# EAGLE design LPT3,5 (EAGLE 6.3)
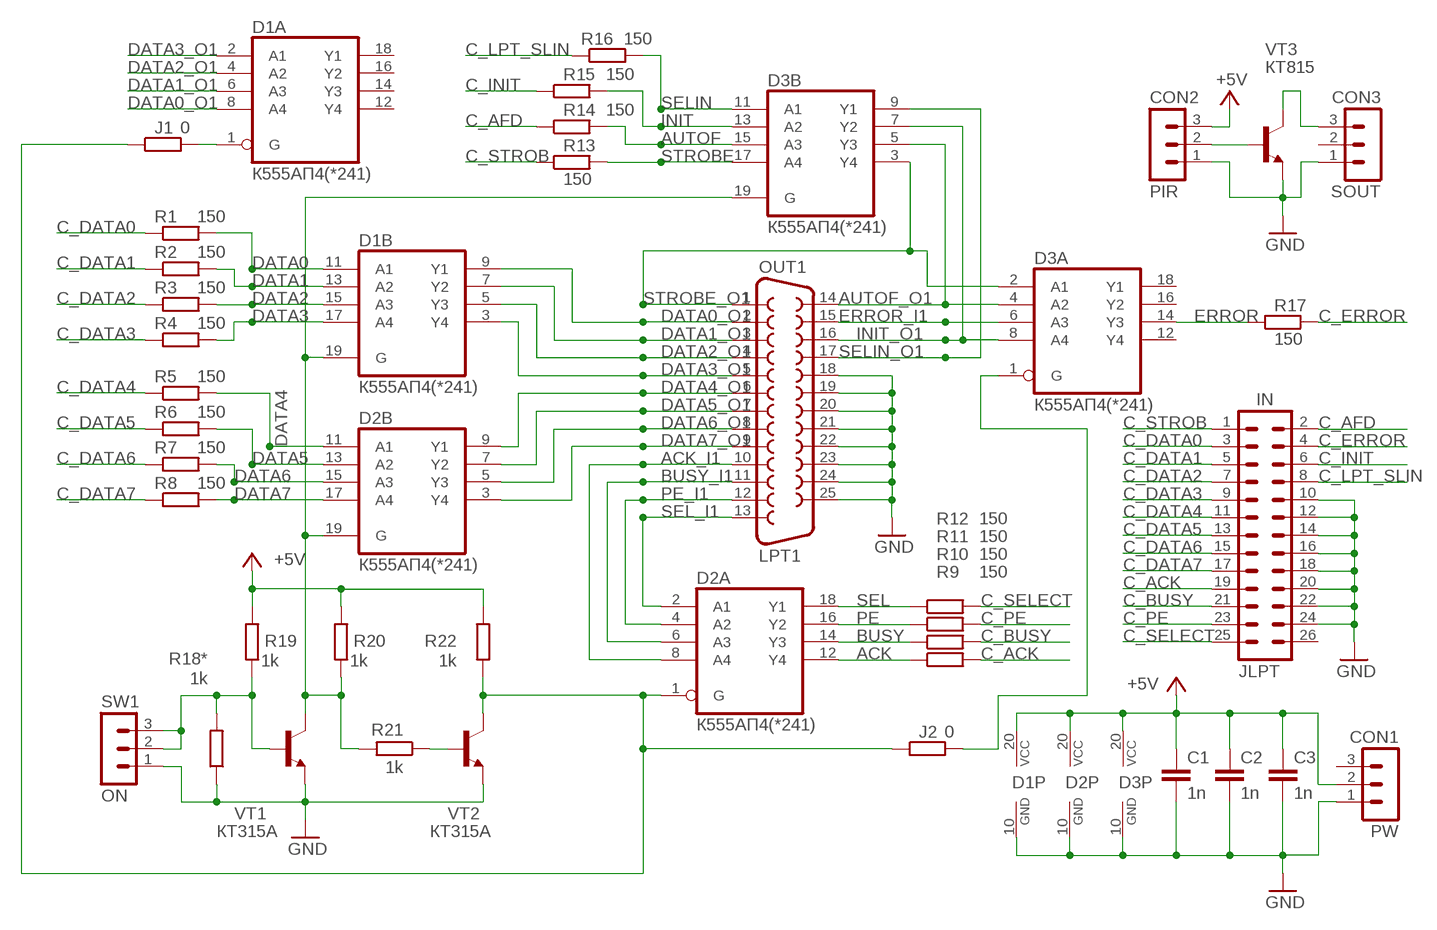
[diagram p0: schematic, sheet 1]

## Parts
C1  1n  C-EU050-024X044  [C050-024X044]
C2  1n  C-EU075-032X103  [C075-032X103]
C3  1n  C-EU050-024X044  [C050-024X044]
CON1  PW  MA03-1  [MA03-1]
CON2  PIR  MA03-1  [MA03-1]
CON3  SOUT  MA03-1  [MA03-1]
D1  К555АП4(*241)  74AC241N  [DIL20]
D2  К555АП4(*241)  74AC241N  [DIL20]
D3  К555АП4(*241)  74AC241N  [DIL20]
IN  JLPT  MA13-2  [MA13-2]
J1  0  R-EU_R1206  [R1206]
J2  0  R-EU_R1206  [R1206]
OUT1  LPT1  F25HP  [F25HP]
R1  150  R-EU_0204/7  [0204/7]
R2  150  R-EU_0204/7  [0204/7]
R3  150  R-EU_0204/7  [0204/7]
R4  150  R-EU_0204/7  [0204/7]
R5  150  R-EU_0204/7  [0204/7]
R6  150  R-EU_0204/7  [0204/7]
R7  150  R-EU_0204/7  [0204/7]
R8  150  R-EU_0204/7  [0204/7]
R9  150  R-EU_0204/7  [0204/7]
R10  150  R-EU_0204/7  [0204/7]
R11  150  R-EU_0204/7  [0204/7]
R12  150  R-EU_0204/7  [0204/7]
R13  150  R-EU_M0805  [M0805]
R14  150  R-EU_M0805  [M0805]
R15  150  R-EU_M0805  [M0805]
R16  150  R-EU_M0805  [M0805]
R17  150  R-EU_M0805  [M0805]
R18*  1k  R-EU_M0805  [M0805]
R19  1k  R-EU_M1206  [M1206]
R20  1k  R-EU_M0805  [M0805]
R21  1k  R-EU_M0805  [M0805]
R22  1k  R-EU_M0805  [M0805]
SW1  ON  MA03-1  [MA03-1]
VT1  КТ315А  2SC1740  [TO92-ECB]
VT2  КТ315А  2SC1740  [TO92-ECB]
VT3  КТ815  2SC1306  [TO220BV]

## Nets
+5V: C1.1 C2.1 C3.1 CON1.2 CON2.3 D1.20(P:VCC) D2.20(P:VCC) D3.20(P:VCC) R19.2 R20.2 R22.2
ACK: D2.12(A:Y4) R9.1
ACK_I1: D2.8(A:A4) OUT1.10
AUTOF: D3.15(B:A3) R14.2
AUTOF_O1: D3.4(A:A2) D3.5(B:Y3) OUT1.14
BUSY: D2.14(A:Y3) R10.1
BUSY_I1: D2.6(A:A3) OUT1.11
C_ACK: IN.19 R9.2
C_AFD: IN.2 R14.1
C_BUSY: IN.21 R10.2
C_DATA0: IN.3 R1.1
C_DATA1: IN.5 R2.1
C_DATA2: IN.7 R3.1
C_DATA3: IN.9 R4.1
C_DATA4: IN.11 R5.1
C_DATA5: IN.13 R6.1
C_DATA6: IN.15 R7.1
C_DATA7: IN.17 R8.1
C_ERROR: IN.4 R17.2
C_INIT: IN.6 R15.1
C_LPT_SLIN: IN.8 R16.1
C_PE: IN.23 R11.2
C_SELECT: IN.25 R12.2
C_STROB: IN.1 R13.1
DATA0: D1.11(B:A1) R1.2
DATA0_O1: D1.8(A:A4) D1.9(B:Y1) OUT1.2
DATA1: D1.13(B:A2) R2.2
DATA1_O1: D1.6(A:A3) D1.7(B:Y2) OUT1.3
DATA2: D1.15(B:A3) R3.2
DATA2_O1: D1.4(A:A2) D1.5(B:Y3) OUT1.4
DATA3: D1.17(B:A4) R4.2
DATA3_O1: D1.2(A:A1) D1.3(B:Y4) OUT1.5
DATA4: D2.11(B:A1) R5.2
DATA4_O1: D2.9(B:Y1) OUT1.6
DATA5: D2.13(B:A2) R6.2
DATA5_O1: D2.7(B:Y2) OUT1.7
DATA6: D2.15(B:A3) R7.2
DATA6_O1: D2.5(B:Y3) OUT1.8
DATA7: D2.17(B:A4) R8.2
DATA7_O1: D2.3(B:Y4) OUT1.9
ERROR: D3.14(A:Y3) R17.1
ERROR_I1: D3.6(A:A3) OUT1.15
GND: C1.2 C2.2 C3.2 CON1.1 CON2.1 CON3.1 D1.10(P:GND) D2.10(P:GND) D3.10(P:GND) IN.10 IN.12 IN.14 IN.16 IN.18 IN.20 IN.22 IN.24 OUT1.18 OUT1.19 OUT1.20 OUT1.21 OUT1.22 OUT1.23 OUT1.24 OUT1.25 R18*.1 SW1.1 VT1.E VT2.E VT3.3(E)
INIT: D3.13(B:A2) R15.2
INIT_O1: D3.7(B:Y2) D3.8(A:A4) OUT1.16
N$1: D1.19(B:G) D2.19(B:G) D3.19(B:G) R20.1 R21.2 VT1.C
N$2: CON2.2 VT3.1(B)
N$3: D2.1(A:G) J1.1 J2.1 R22.1 VT2.C
N$4: D1.1(A:G) J1.2
N$5: R18*.2 R19.1 SW1.2 SW1.3 VT1.B
N$7: D3.1(A:G) J2.2
N$9: CON3.3 VT3.2(C)
N$10: R21.1 VT2.B
PE: D2.16(A:Y2) R11.1
PE_I1: D2.4(A:A2) OUT1.12
SEL: D2.18(A:Y1) R12.1
SEL_I1: D2.2(A:A1) OUT1.13
SELIN: D3.11(B:A1) R16.2
SELIN_O1: D3.9(B:Y1) OUT1.17
STROBE: D3.17(B:A4) R13.2
STROBE_O1: D3.2(A:A1) D3.3(B:Y4) OUT1.1
Unconnected: CON1.3 CON3.2 D1.12(A:Y4) D1.14(A:Y3) D1.16(A:Y2) D1.18(A:Y1) D3.12(A:Y4) D3.16(A:Y2) D3.18(A:Y1) IN.26

## Library data of the parts
C1-C3 = rcl:C-EU: CAPACITOR, European symbol
CON1-CON3 SW1 = con-lstb:MA03-1: PIN HEADER; OC_FARNELL: unknown; OC_NEWARK: unknown
D1-D3 = 74xx-eu:74*241: Octal BUFFER and LINE DRIVER, 3-state
IN = con-lstb:MA13-2: PIN HEADER; OC_FARNELL: unknown; OC_NEWARK: unknown
J1 J2 R1-R17 R18* R19-R22 = rcl:R-EU_: RESISTOR, European symbol
OUT1 = con-subd:F25: SUB-D; OC_FARNELL: unknown; OC_NEWARK: unknown
VT1 VT2 = transistor:2SC1740: NPN Silicon Epitaxial Planar Transistor Source: SEMTECH ELECTRONICS LTD. 2SC1740.pdf
VT3 = transistor:2SC1306: NPN Transistor Final RF Power Outupt Source: 2sc1306.pdf

## Board
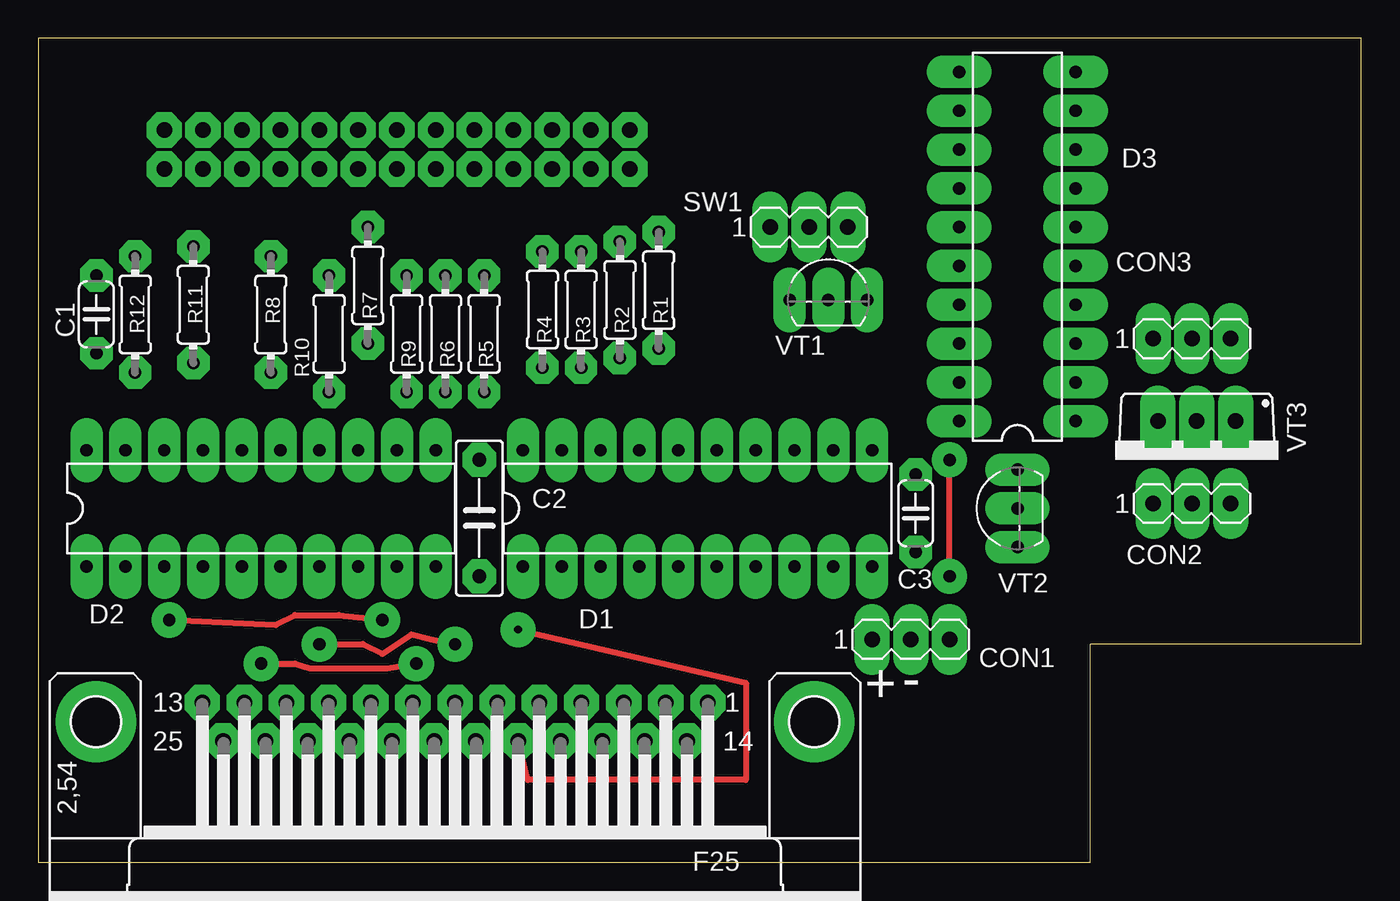
[diagram p1: board, top side]
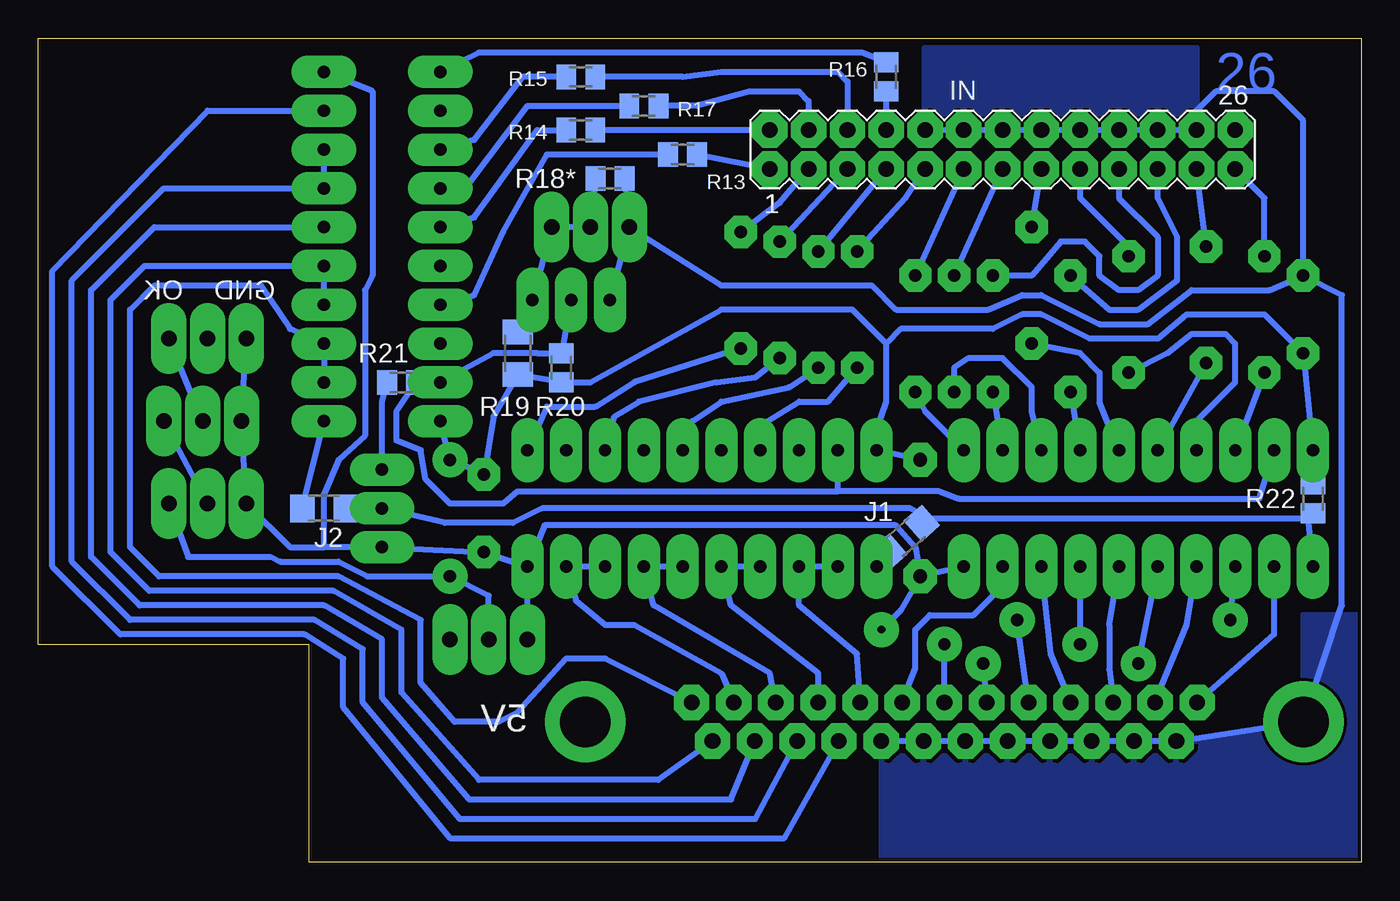
[diagram p2: board, bottom side, seen from below]

Size 86.66 x 53.96 mm. Coordinates in mm from the lower left corner, seen from the top.
Outline: 0,0 68.9,0 68.9,14.29 86.66,14.29 86.66,53.96 0,53.96 0,0
Copper layers (1*16): Top 0.035mm / dielectric 1.5mm / Bottom 0.035mm
Design rules "DesignRules": minimum track width 8mil, minimum drill 24mil, track to track 0.2mm, track to pad 0.2mm, pad to pad 8mil, via to via 8mil, smd to smd 8mil, copper to edge 10mil, drill to drill 8mil, minimum pad ring 0.65mm, minimum via ring 8mil, stop-mask expansion 4mil, vias tented up to drill 0mil, thermal gap 10mil

### Footprints (pad centres in the part's own frame; a part is rotated, then mirrored left to right if it is on the bottom)
C050-024X044 = drill 0.813 octagon: 1 -2.54,0; 2 2.54,0
C075-032X103 = drill 0.914 octagon: 1 -3.81,0; 2 3.81,0
MA03-1 = drill 1.016 long: 1 -2.54,0; 2 0,0; 3 2.54,0
DIL20 = drill 0.813 long: 1 -11.43,-3.81; 2 -8.89,-3.81; 3 -6.35,-3.81; 4 -3.81,-3.81; 5 -1.27,-3.81; 6 1.27,-3.81; 7 3.81,-3.81; 8 6.35,-3.81; 9 8.89,-3.81; 10 11.43,-3.81; 11 11.43,3.81; 12 8.89,3.81; 13 6.35,3.81; 14 3.81,3.81; 15 1.27,3.81; 16 -1.27,3.81; 17 -3.81,3.81; 18 -6.35,3.81; 19 -8.89,3.81; 20 -11.43,3.81
MA13-2 = drill 1.016 octagon: 1 -15.24,-1.27; 2 -15.24,1.27; 3 -12.7,-1.27; 4 -12.7,1.27; 5 -10.16,-1.27; 6 -10.16,1.27; 7 -7.62,-1.27; 8 -7.62,1.27; 9 -5.08,-1.27; 10 -5.08,1.27; 11 -2.54,-1.27; 12 -2.54,1.27; 13 0,-1.27; 14 0,1.27; 15 2.54,-1.27; 16 2.54,1.27; 17 5.08,-1.27; 18 5.08,1.27; 19 7.62,-1.27; 20 7.62,1.27; 21 10.16,-1.27; 22 10.16,1.27; 23 12.7,-1.27; 24 12.7,1.27; 25 15.24,-1.27; 26 15.24,1.27
R1206 = smd 1.6 x 1.803: 1 -1.422,0; 2 1.422,0
F25HP = drill 1.016 octagon: 1 -16.561,-1.27; 2 -13.792,-1.27; 3 -11.049,-1.27; 4 -8.28,-1.27; 5 -5.512,-1.27; 6 -2.769,-1.27; 7 0,-1.27; 8 2.769,-1.27; 9 5.512,-1.27; 10 8.28,-1.27; 11 11.049,-1.27; 12 13.792,-1.27; 13 16.561,-1.27; 14 -15.189,1.27; 15 -12.421,1.27; 16 -9.652,1.27; 17 -6.909,1.27; 18 -4.14,1.27; 19 -1.372,1.27; 20 1.372,1.27; 21 4.14,1.27; 22 6.909,1.27; 23 9.652,1.27; 24 12.421,1.27; 25 15.189,1.27 | drill 3.302 pad 5.08: G1 -23.52,0; G2 23.52,0
0204/7 = drill 0.813 octagon: 1 -3.81,0; 2 3.81,0
M0805 = smd 1.3 x 1.6: 1 -0.95,0; 2 0.95,0
M1206 = smd 1.6 x 2: 1 -1.4,0; 2 1.4,0
TO92-ECB = drill 0.813 long: B 2.54,0; C 0,0; E -2.54,0
TO220BV = drill 1.016 long: 1 -2.54,-2.54; 2 0,-2.54; 3 2.54,-2.54

### Placement (x,y rotation side)
C1  3.81,35.88 90 top
C2  28.89,22.54 270 top
C3  57.47,22.86 270 top
CON1  57.15,14.61 0 top
CON2  75.56,23.5 0 top
CON3  75.56,34.29 0 top
D1  43.18,23.18 0 top
D2  14.6,23.18 0 top
D3  64.14,40.32 90 top
IN  23.49,46.67 0 bottom
J1  29.84,21.27 221.5 bottom
J2  67.94,23.18 180 bottom
OUT1  27.3,9.21 180 top
R1  40.64,37.47 270 top
R2  38.1,36.83 270 top
R3  35.56,36.19 270 top
R4  33.02,36.19 270 top
R5  29.21,34.61 270 top
R6  26.67,34.61 270 top
R7  21.59,37.78 270 top
R8  15.24,35.88 270 top
R9  24.13,34.61 90 top
R10  19.05,34.61 90 top
R11  10.16,36.51 90 top
R12  6.35,35.88 90 top
R13  44.45,46.36 180 bottom
R14  51.12,47.94 180 bottom
R15  51.12,51.44 180 bottom
R16  31.11,51.44 90 bottom
R17  46.99,49.53 0 bottom
R18*  49.21,44.77 180 bottom
R19  55.24,33.34 270 bottom
R20  52.39,32.39 270 bottom
R21  62.86,31.43 0 bottom
R22  3.17,23.81 90 bottom
SW1  50.48,41.59 0 top
VT1  51.75,36.83 0 top
VT2  64.14,23.18 90 top
VT3  75.88,26.35 180 top

### Tracks (layer width: path | path; a pad name or v marks a point on that pad's centre or on a via)
+5V  (via drill 0.8 pad 2.3)
  Top 0.406: v59.69,18.73 v59.69,26.35
  Bottom 0.406: C2.1 D1.20 31.75,28.26 31.11,30.16 31.11,33.97 | R22.2 D2.20 C1.1 6.35,35.88 11.43,35.88 13.33,34.29 17.78,34.29 20.95,35.88 22.22,35.88 24.13,34.93 30.16,34.93 31.11,33.97 | D3.20 v59.69,26.35 C3.1 56.83,29.21 R19.2 R20.2 50.48,31.43 41.91,36.19 33.34,36.19 31.11,33.97 | CON2.3 76.83,20 71.44,20 70.8,19.68 66.99,19.68 65.09,18.73 v59.69,18.73 57.15,17.46 CON1.2
ACK
  Bottom 0.406: R9.1 D2.12
ACK_I1
  Bottom 0.406: OUT1.10 20.32,13.65 D2.8
AUTOF
  Bottom 0.406: D3.15 58.1,42.23 53.98,47.94 R14.2
AUTOF_O1
  Bottom 0.406: OUT1.14 46.04,5.4 57.78,5.4 62.86,11.11 62.86,15.24 67.31,17.78 79.38,17.78 81.91,20.32 81.91,36.83 79.69,39.05 D3.5 D3.4
BUSY
  Bottom 0.406: R10.1 D2.14
BUSY_I1
  Bottom 0.406: D2.6 16.51,15.56 16.51,12.64 OUT1.11
C_ACK
  Bottom 0.406: IN.19 15.88,43.5 13.33,40.96 13.33,38.42 14.6,37.46 15.88,37.46 17.15,38.42 17.15,39.69 18.1,40.64 19.69,40.64 21.59,38.42 R9.2
C_AFD
  Bottom 0.406: IN.2 R14.1
C_BUSY
  Bottom 0.406: R10.2 16.51,36.19 14.6,36.19 12.06,38.1 12.06,40.96 13.33,43.5 IN.21
C_DATA0
  Bottom 0.406: IN.3 38.1,43.18 R1.1
C_DATA1
  Bottom 0.406: R2.1 IN.5
C_DATA2
  Bottom 0.406: R3.1 IN.7
C_DATA3
  Bottom 0.406: R4.1 29.85,43.5 IN.9
C_DATA4
  Bottom 0.406: R5.1 IN.11
C_DATA5
  Bottom 0.406: R6.1 IN.13
C_DATA6
  Bottom 0.406: R7.1 IN.15
C_DATA7
  Bottom 0.406: IN.17 18.42,43.5 15.24,40.32 R8.1
C_ERROR
  Bottom 0.406: IN.4 36.2,49.85 36.83,50.48 40,50.48 43.5,49.53 R17.2
C_INIT
  Bottom 0.406: IN.6 33.66,51.12 34.29,51.75 41.91,51.75 44.45,51.44 R15.1
C_LPT_SLIN
  Bottom 0.406: IN.8 R16.1
C_PE
  Bottom 0.406: R11.2 IN.23
C_SELECT
  Bottom 0.406: R12.2 6.35,43.5 IN.25
C_STROB
  Bottom 0.406: R13.1 IN.1
DATA0
  Bottom 0.406: D1.11 53.34,29.85 50.17,29.85 47.63,31.43 R1.2
DATA0_O1
  Bottom 0.406: OUT1.2 41.91,12.38 47.63,15.56 49.53,15.56 51.43,17.14 D1.9 D1.8
DATA1
  Bottom 0.406: D1.13 48.89,29.21 47.31,30.16 42.23,31.43 39.69,31.75 R2.2
DATA1_O1
  Bottom 0.406: OUT1.3 38.74,12.38 46.35,16.83 D1.7 D1.6
DATA2
  Bottom 0.406: D1.15 43.81,28.89 41.91,30.16 37.46,31.11 R3.2
DATA2_O1
  Bottom 0.406: OUT1.4 35.56,12.38 41.28,16.83 D1.5 D1.4
DATA3
  Bottom 0.406: D1.17 39.37,28.57 36.83,30.16 34.92,30.16 R4.2
DATA3_O1
  Bottom 0.406: OUT1.5 33.02,13.65 36.83,16.83 D1.3 D1.2
DATA4
  Bottom 0.406: R5.2 28.58,29.53 D2.11
DATA4_O1
  Bottom 0.406: D2.9 24.13,17.46 25.4,16.19 28.26,16.19 29.21,15.24 29.21,12.7 OUT1.6
DATA5
  Bottom 0.406: D2.13 21.59,29.53 21.59,31.11 23.49,33.02 25.72,33.02 26.67,32.39 R6.2
DATA5_O1  (via drill 0.8 pad 2.3)
  Top 0.406: v18.42,14.29 21.27,14.29 22.54,13.65 24.45,14.92 25.72,14.61 v27.31,14.29
  Bottom 0.406: OUT1.7 v27.31,14.29 | v18.42,14.29 D2.7
DATA6
  Bottom 0.406: D2.15 17.15,30.16 17.15,32.07 18.42,33.34 R7.2
DATA6_O1  (via drill 0.8 pad 2.3)
  Top 0.406: v14.6,13.02 16.83,13.02 17.78,12.7 22.86,12.7 v24.76,13.02
  Bottom 0.406: OUT1.8 v24.76,13.02 | v14.6,13.02 D2.5
DATA7
  Bottom 0.406: D2.17 11.43,28.26 8.26,31.43 8.26,33.97 8.89,34.61 11.11,34.61 12.7,33.34 R8.2
DATA7_O1  (via drill 0.8 pad 2.3)
  Top 0.406: v8.57,15.87 15.56,15.56 16.83,16.19 19.69,16.19 v22.54,15.87
  Bottom 0.406: OUT1.9 v22.54,15.87 | v8.57,15.87 D2.3
ERROR
  Bottom 0.406: D3.14 58.42,44.45 54.61,49.53 R17.1
ERROR_I1
  Bottom 0.406: OUT1.15 41.28,4.13 58.42,4.13 64.14,10.8 64.14,14.61 67.94,16.83 80.01,16.83 83.19,20 83.19,37.46 79.06,41.59 D3.6
GND  (via drill 0.5 pad 2.3)
  Top 0.406: v31.43,15.24 46.35,11.75 46.35,5.4 32.07,5.4 OUT1.18
  Bottom 0.406: OUT1.18 OUT1.19 OUT1.20 OUT1.21 OUT1.22 OUT1.23 OUT1.24 OUT1.25 3.81,9.21 1.27,16.83 1.27,37.15 C1.2 | D2.10 C2.2 | IN.10 IN.12 IN.14 IN.16 IN.18 IN.20 IN.22 IN.24 10.79,49.21 9.53,50.48 5.71,50.48 3.81,48.58 C1.2 | D1.10 53.5,22.07 30.48,22.07 29.21,20.64 C2.2 | D1.10 C3.2 VT2.E 67.94,20.64 | D3.10 64.77,50.48 64.77,38.42 65.25,37.46 65.25,27.94 66.99,26.35 67.94,24.13 67.94,20.64 | C2.2 30.16,16.51 v31.43,15.24 | CON1.1 D1.10 | SW1.1 41.91,37.78 32.07,37.78 30.48,36.19 24.45,36.19 22.22,37.15 20.95,37.15 17.15,35.24 13.97,35.24 11.11,37.46 6.03,37.46 C1.2 | VT1.E SW1.1 | R18*.1 SW1.1 | 67.94,20.64 70.17,20.64 CON2.1 VT3.3 CON3.1
  pour Bottom: 31.43,7.94 31.43,0.32 0.32,0.32 0.32,16.19 3.81,16.19 3.81,8.89 12.06,7.94
  pour Bottom: 10.79,47.94 28.58,47.94 28.58,53.34 10.79,53.34
INIT
  Bottom 0.406: R15.2 54.93,51.44 58.1,47.31 D3.13
INIT_O1
  Bottom 0.406: OUT1.16 39.69,2.86 59.06,2.86 65.41,10.48 65.41,13.97 68.58,15.87 80.64,15.87 84.45,19.68 84.45,38.1 78.42,44.13 D3.7 D3.8
N$1
  Bottom 0.406: 34.29,24.29 27.62,24.29 26.35,23.81 6.67,23.81 D2.19 | 34.29,24.29 D1.19 | 34.29,24.29 55.24,24.29 56.2,23.5 59.69,23.5 61.28,25.08 61.6,26.99 63.18,27.62 63.18,29.53 R21.2 D3.19 56.83,33.34 53.98,33.34 R20.1 VT1.C
N$2
  Bottom 0.406: CON2.2 VT3.1
N$3
  Bottom 0.406: 28.42,22.61 29.53,23.18 53.66,23.18 55.56,22.22 60.01,22.22 VT2.C J2.1 | 28.42,22.61 28.26,22.54 3.49,22.54 | 3.49,22.54 D2.1 | 3.49,22.54 R22.1 | J1.1 28.42,22.61
N$4
  Bottom 0.406: J1.2 D1.1
N$5
  Bottom 0.406: R19.1 VT1.B SW1.3 SW1.2 R18*.2
N$7
  Bottom 0.406: J2.2 D3.1
N$9
  Bottom 0.406: VT3.2 CON3.3
N$10
  Bottom 0.406: VT2.B 64.14,30.16 R21.1
PE
  Bottom 0.406: R11.1 D2.16
PE_I1
  Bottom 0.406: OUT1.12 11.43,15.56 D2.4
SEL
  Bottom 0.406: R12.1 D2.18
SEL_I1
  Bottom 0.406: OUT1.13 5.71,14.92 D2.2
SELIN
  Bottom 0.406: D3.11 57.78,53.02 32.7,53.02 R16.2
SELIN_O1
  Bottom 0.406: OUT1.17 37.78,1.59 59.69,1.59 66.67,10.16 66.67,13.34 69.22,14.92 81.28,14.92 85.72,19.37 85.72,38.74 75.56,49.21 D3.9
STROBE
  Bottom 0.406: D3.17 58.1,37.15 56.2,41.28 53.34,46.36 R13.2
STROBE_O1
  Bottom 0.406: D3.2 D3.3 70.17,34.93 72.07,37.78 79.06,37.78 80.64,36.19 80.64,20.64 78.74,18.73 66.99,18.73 61.6,15.87 61.6,11.75 59.37,9.21 56.52,9.21 55.24,9.84 52.07,13.34 49.53,13.34 OUT1.1

### Text on the board
Bottom: 26
tNames: + | -
bNames: GND | OK | 5V